# EAGLE design Audio-Amplifier-RickAndersen (EAGLE 7.2.0)
A Simple Audio Amplifier for your radio projects Nov. 23, 2004 by Rick Andersen http://www.ke3ij.com/amp.htm
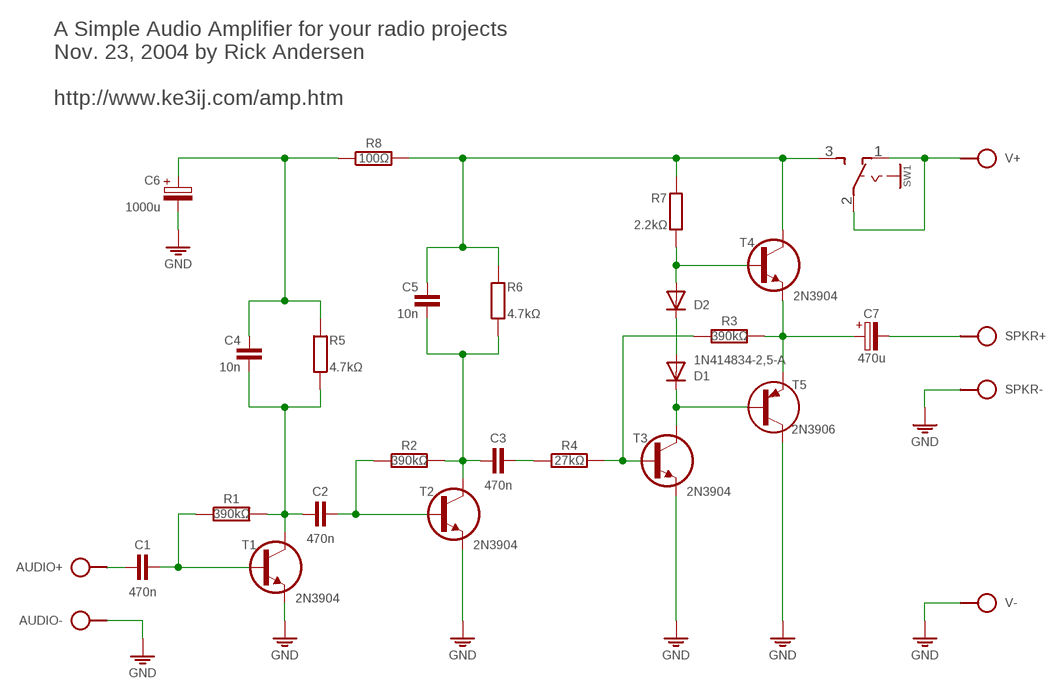
[diagram p0: schematic, sheet 1]

## Parts
AUDIO  SPAD+-+-  [SPAD+-]
C1  470n  C050-020X044  [C050-020X044]
C2  470n  C050-020X044  [C050-020X044]
C3  470n  C050-020X044  [C050-020X044]
C4  10n  C025-015X024  [C025-015X024]
C5  10n  C025-015X024  [C025-015X024]
C6  1000u  CPOLE5-6  [E5-6]
C7  470u  CPOLE5-6  [E5-6]
D1  1N414834-2,5-A  [DO34-2,5-A]
D2  1N414834-5V  [DO34-5V]
R1  390kΩ  R-H0202/7-V  [0202/7-V]
R2  390kΩ  R-H0202/7-V  [0202/7-V]
R3  390kΩ  R-H0202/7-V  [0202/7-V]
R4  27kΩ  R-H0202/7-V  [0202/7-V]
R5  4.7kΩ  R0202/7-V  [0202/7-V]
R6  4.7kΩ  R0202/7-V  [0202/7-V]
R7  2.2kΩ  R0202/7  [0202/7]
R8  100Ω  R-H0202/7  [0202/7]
SPKR  SPAD+-+-  [SPAD+-]
SW1  SL-SW-1P-2T-H  [SLSW-1P2T-H]
T1  2N3904  [TO92]
T2  2N3904  [TO92]
T3  2N3904  [TO92]
T4  2N3904  [TO92]
T5  2N3906  [TO92]
V+  SPAD  [SPAD]
V-  SPAD  [SPAD]

## Nets
GND: AUDIO.1 C6.- SPKR.1 T1.1(E) T2.1(E) T3.1(E) T5.3(C) V-.1
N$1: C1.2 R1.1 T1.2(B)
N$2: C7.+ R3.2 T4.1(E) T5.1(E)
N$3: C2.2 R2.1 T2.2(B)
N$4: D1.C T3.3(C) T5.2(B)
N$5: R3.1 R4.2 T3.2(B)
N$6: C3.2 R4.1
N$7: C2.1 C4.2 R1.2 R5.2 T1.3(C)
N$8: C4.1 C6.+ R5.1 R8.1
N$9: C3.1 C5.2 R2.2 R6.2 T2.3(C)
N$10: SW1.1(O) SW1.2(P) V+.1
N$11: D1.A D2.C
N$12: D2.A R7.2 T4.2(B)
N$13: C5.1 R6.1 R7.1 R8.2 SW1.3(S) T4.3(C)
N$14: AUDIO.2 C1.1
N$15: C7.- SPKR.2

## Notes on the sheet
- A Simple Audio Amplifier for your radio projects
  Nov. 23, 2004 by Rick Andersen
  
  http://www.ke3ij.com/amp.htm

## Library data of the parts
AUDIO SPKR = pad:SPAD+-
C1-C5 = c:C: CAPACITOR, European symbol
C6 C7 = c:CPOL: POLARIZED CAPACITOR, European symbol
D1 D2 = d:1N4148
R1-R4 R8 = r:R-H
R5-R7 = r:R: RESISTOR, European symbol
SW1 = sw:SL-SW-1P-2T
T1-T4 = t:2N3904
T5 = t:2N3906
V+ V- = pad:SPAD

## Net classes
0 default: width 0.61 mm

## Board
A Simple Audio Amplifier for your radio projects Nov. 23, 2004 by Rick Andersen http://www.ke3ij.com/amp.htm
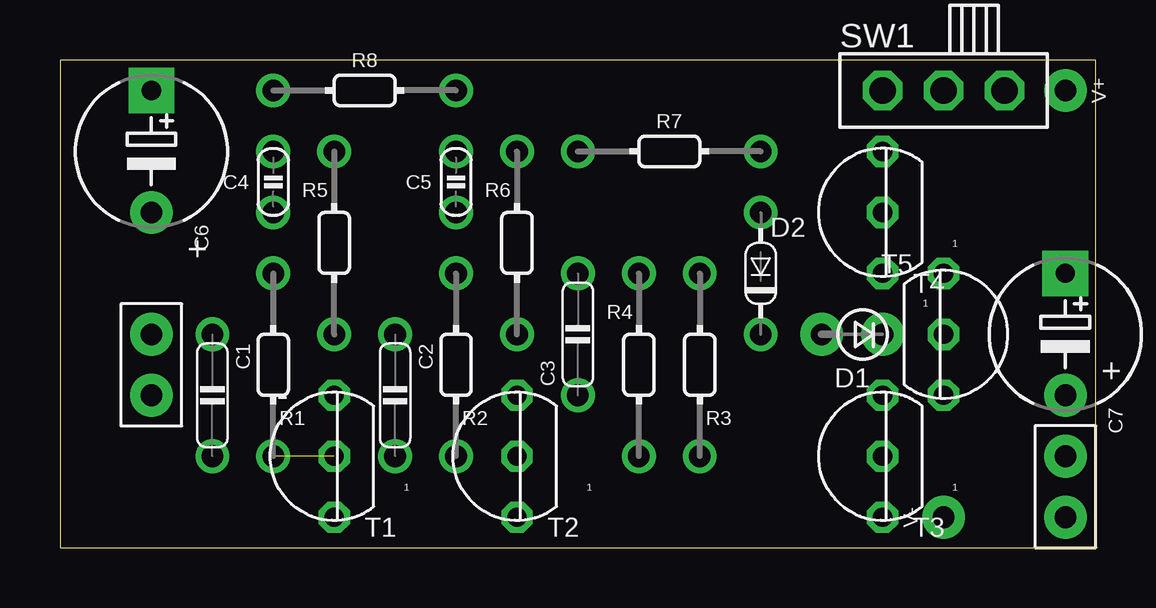
[diagram p1: board, top side]
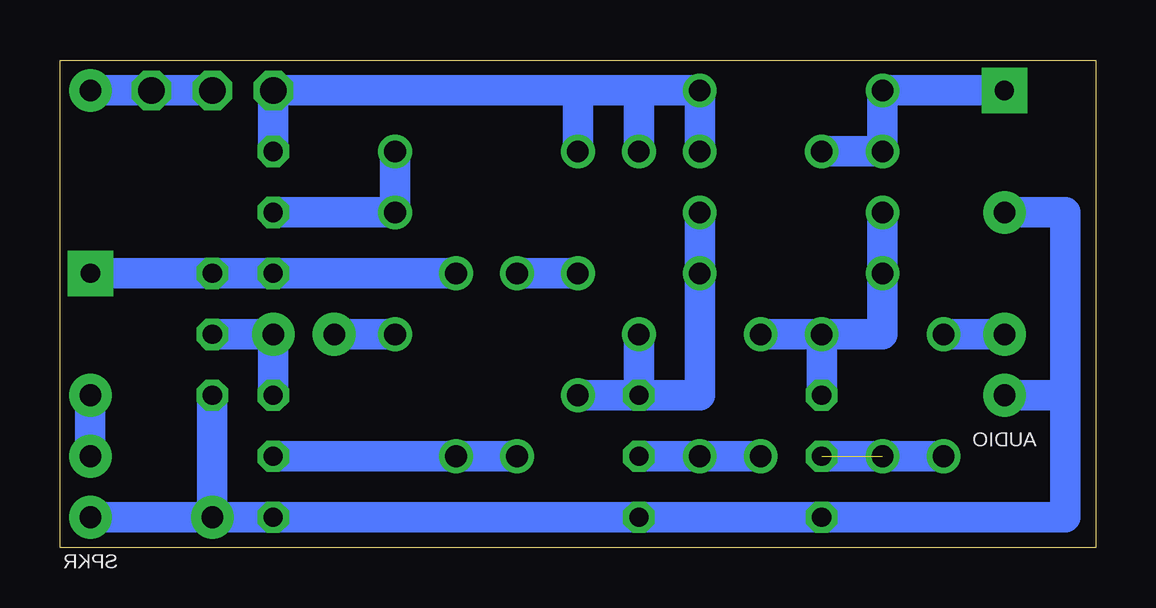
[diagram p2: board, bottom side, seen from below]

Size 43.18 x 20.32 mm. Coordinates in mm from the lower left corner, seen from the top.
Outline: 0,0 43.18,0 43.18,20.32 0,20.32 0,0
Copper layers (1*16): Top 0.035mm / dielectric 1.5mm / Bottom 0.035mm
Design rules "default": minimum track width 10mil, minimum drill 24mil, track to track 8mil, track to pad 8mil, pad to pad 8mil, via to via 8mil, smd to smd 8mil, copper to edge 40mil, drill to drill 8mil, minimum pad ring 10mil, minimum via ring 8mil, stop-mask expansion 4mil, vias tented up to drill 0mil, thermal gap 10mil

### Footprints (pad centres in the part's own frame; a part is rotated, then mirrored left to right if it is on the bottom)
SPAD+- = drill 0.9 pad 1.778: 1 0,-1.27; 2 0,1.27
C050-020X044 = drill 0.9: 1 -2.54,0; 2 2.54,0
C025-015X024 = drill 0.9: 1 0,1.27; 2 0,-1.27
E5-6 = drill 0.8 pad 1.905 square: + -2.54,0 | drill 0.9 pad 1.778: - 2.54,0
DO34-2,5-A = drill 0.9 pad 1.778: A 1.27,0; C -1.27,0
DO34-5V = drill 0.9: A 0,2.54; C 0,-2.54
0202/7-V = drill 0.9: 1 0,3.81; 2 0,-3.81
0202/7 = drill 0.9: 1 -3.81,0; 2 3.81,0
SLSW-1P2T-H = drill 1.1 pad 1.524 octagon: 1 2.54,0; 2 0,0; 3 -2.54,0
TO92 = drill 0.8 octagon: 1 0,2.54; 2 0,0; 3 0,-2.54
SPAD = drill 0.9 pad 1.778: 1 0,0

### Placement (x,y rotation side)
AUDIO  3.81,7.62 0 top
C1  6.35,6.35 270 top
C2  13.97,6.35 270 top
C3  21.59,8.89 90 top
C4  8.89,15.24 0 top
C5  16.51,15.24 0 top
C6  3.81,16.51 270 top
C7  41.91,8.89 270 top
D1  33.02,8.89 180 top
D2  29.21,11.43 0 top
R1  8.89,7.62 180 top
R2  16.51,7.62 180 top
R3  26.67,7.62 180 top
R4  24.13,7.62 0 top
R5  11.43,12.7 0 top
R6  19.05,12.7 0 top
R7  25.4,16.51 0 top
R8  12.7,19.05 0 top
SPKR  41.91,2.54 0 top
SW1  36.83,19.05 0 top
T1  11.43,3.81 180 top
T2  19.05,3.81 180 top
T3  34.29,3.81 180 top
T4  34.29,13.97 180 top
T5  36.83,8.89 0 top
V+  41.91,19.05 180 top
V-  36.83,1.27 0 top

### Tracks (layer width: path | path; a pad name or v marks a point on that pad's centre or on a via)
GND
  Bottom 1.27: 1.27,6.35 1.27,1.27 T1.1 T2.1 T3.1 V-.1 | C6.- 1.27,13.97 1.27,6.35 | 1.27,6.35 AUDIO.1 | T5.3 V-.1 | V-.1 SPKR.1
N$1  (1 unrouted)
  Bottom 1.27: C1.2 T1.2
N$2
  Bottom 1.27: R3.2 T4.1 C7.+ T5.1
N$3
  Bottom 1.27: C2.2 R2.1 T2.2
N$4
  Bottom 1.27: T5.2 D1.C T3.3
N$5
  Bottom 1.27: T3.2 R3.1 R4.2
N$6
  Bottom 1.27: C3.2 R4.1
N$7
  Bottom 1.27: C4.2 R1.2 8.89,8.89 R5.2 | R5.2 C2.1 | T1.3 R5.2
N$8
  Bottom 1.27: C6.+ R8.1 C4.1 R5.1
N$9
  Bottom 1.27: T2.3 16.51,6.35 R2.2 C5.2 | T2.3 C3.1 | T2.3 R6.2
N$10
  Bottom 1.27: V+.1 SW1.1 SW1.2
N$11
  Bottom 1.27: D1.A D2.C
N$12
  Bottom 1.27: T4.2 D2.A R7.2
N$13
  Bottom 1.27: R7.1 21.59,19.05 | 21.59,19.05 SW1.3 T4.3 | R6.1 19.05,19.05 | 19.05,19.05 21.59,19.05 | C5.1 R8.2 19.05,19.05
N$14
  Bottom 1.27: AUDIO.2 C1.1
N$15
  Bottom 1.27: SPKR.2 C7.-